# EAGLE design pcb (EAGLE 7.7.0)
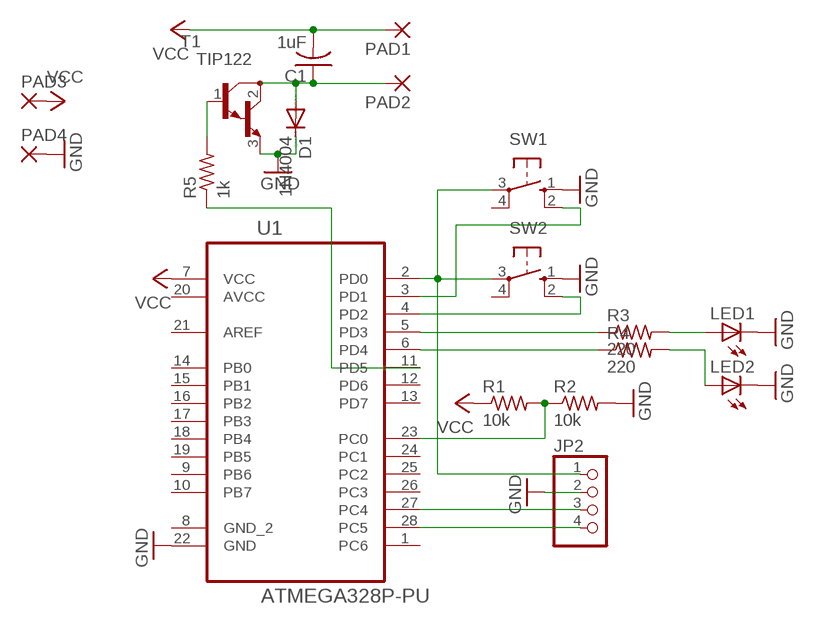
[diagram p0: schematic, sheet 1]

## Parts
C1  1uF  C-US025-025X050  [C025-025X050]
D1  1N4004  [DO41-10]
JP2  PINHD-1X4  [1X04]
LED1  LED5MM  [LED5MM]
LED2  LED5MM  [LED5MM]
PAD1  1,6/0,8  [1,6/0,8]
PAD2  1,6/0,8  [1,6/0,8]
PAD3  1,6/0,8  [1,6/0,8]
PAD4  1,6/0,8  [1,6/0,8]
R1  10k  R-US_0204/5  [0204/5]
R2  10k  R-US_0204/5  [0204/5]
R3  220  R-US_0204/5  [0204/5]
R4  220  R-US_0204/5  [0204/5]
R5  1k  R-US_0204/5  [0204/5]
SW1  10-XX  [B3F-10XX]
SW2  10-XX  [B3F-10XX]
T1  TIP122  [TO220]
U1  ATMEGA328P-PU  [DIP254P762X457-28]

## Nets
GND: D1.C JP2.2 LED1.K(C) LED2.K(C) PAD4.1(P) R2.2 SW1.1(S) SW2.1(S) T1.3(E) U1.22(GND)
N$1: JP2.3 U1.27(PC4)
N$2: C1.1 D1.A PAD2.1(P) T1.2(C)
N$3: JP2.4 U1.28(PC5)
N$4: R1.2 R2.1 U1.23(PC0)
N$5: JP2.1 SW1.3(P) SW2.3(P) U1.2(PD0)
N$6: SW1.2(S1) U1.3(PD1)
N$7: SW2.2(S1) U1.4(PD2)
N$8: R3.1 U1.5(PD3)
N$9: R4.1 U1.6(PD4)
N$10: LED1.A R3.2
N$11: LED2.A R4.2
N$12: R5.2 T1.1(B)
N$13: R5.1 U1.11(PD5)
VCC: C1.2 PAD1.1(P) PAD3.1(P) R1.1 U1.7(VCC)
Unconnected: SW1.4(P1) SW2.4(P1) U1.1(PC6) U1.8(GND_2) U1.9(PB6) U1.10(PB7) U1.12(PD6) U1.13(PD7) U1.14(PB0) U1.15(PB1) U1.16(PB2) U1.17(PB3) U1.18(PB4) U1.19(PB5) U1.21(AREF) U1.24(PC1) U1.25(PC2) U1.26(PC3)

## Power pins joined to a net without a drawn wire
AVCC: U1.20(AVCC)

## Library data of the parts
C1 = adafruit:C-US: CAPACITOR, American symbol
D1 = diode:1N4004: DIODE general purpose rectifier, 1 A
JP2 = pinhead:PINHD-1X4: PIN HEADER
LED1 LED2 = adafruit:LED: LED OSRAM: - CHIPLED LG R971, LG N971, LY N971, LG Q971, LY Q971, LO R971, LY R971 LH N974, LH R974 LS Q976, LO Q976, LY Q976 LO Q996 - Hyper CHIPLED LW Q18S LB Q993, LB Q99A, LB R99A - SideLED LS A670, LO A670, LY A670, LG A670, LP A670 LB A673, LV A673, LT A673, LW A673 LH A674 LY A675 LS A676, LA A676, LO A676, LY A676, LW A676 LS A679, LY A679, LG A679 - Hyper Micro SIDELED® LS Y876, LA Y876, LO Y876, LY Y876 LT Y87S - SmartLED LW L88C, LW L88S LB L89C, LB L89S, LG L890 LS L89K, LO L89K, LY L89K LS L896, LA L896, LO L896, LY L896 - TOPLED LS T670, LO T670, LY T670, LG T670, LP T670 LSG T670, LSP T670, LSY T670, LOP T670, LYG T670 LG T671, LOG T671, LSG T671 LB T673, LV T673, LT T673, LW T673 LH T674 LS T676, LA T676, LO T676, LY T676, LB T676, LH T676, LSB T676, LW T676 LB T67C, LV T67C, LT T67C, LS T67K, LO T67K, LY T67K, LW E67C LS E67B, LA E67B, LO E67B, LY E67B, LB E67C, LV E67C, LT E67C LW T67C LS T679, LY T679, LG T679 LS T770, LO T770, LY T770, LG T770, LP T770 LB T773, LV T773, LT T773, LW T773 LH T774 LS E675, LA E675, LY E675, LS T675 LS T776, LA T776, LO T776, LY T776, LB T776 LHGB T686 LT T68C, LB T68C - Hyper Mini TOPLED® LB M676 - Mini TOPLED Santana® LG M470 LS M47K, LO M47K, LY M47K Source: http://www.osram.convergy.de/
PAD1-PAD4 = wirepad:1,6/0,8: THROUGH-HOLE PAD
R1-R5 = resistor:R-US_: RESISTOR, American symbol
SW1 SW2 = buttons:10-XX: OMRON SWITCH
T1 = transistor:TIP122: NPN BIPOLAR DARLINGTON TRANSISTOR
U1 = Atmel_By_element14_Batch_1-00:ATMEGA328P-PU: 8-bit Microcontroller with In-System Programmable Flash; MPN: ATMEGA328P-PU; OC_FARNELL: 1715487; OC_NEWARK: 15R0268; PACKAGE: PDIP-28; SUPPLIER: Atmel

## Board
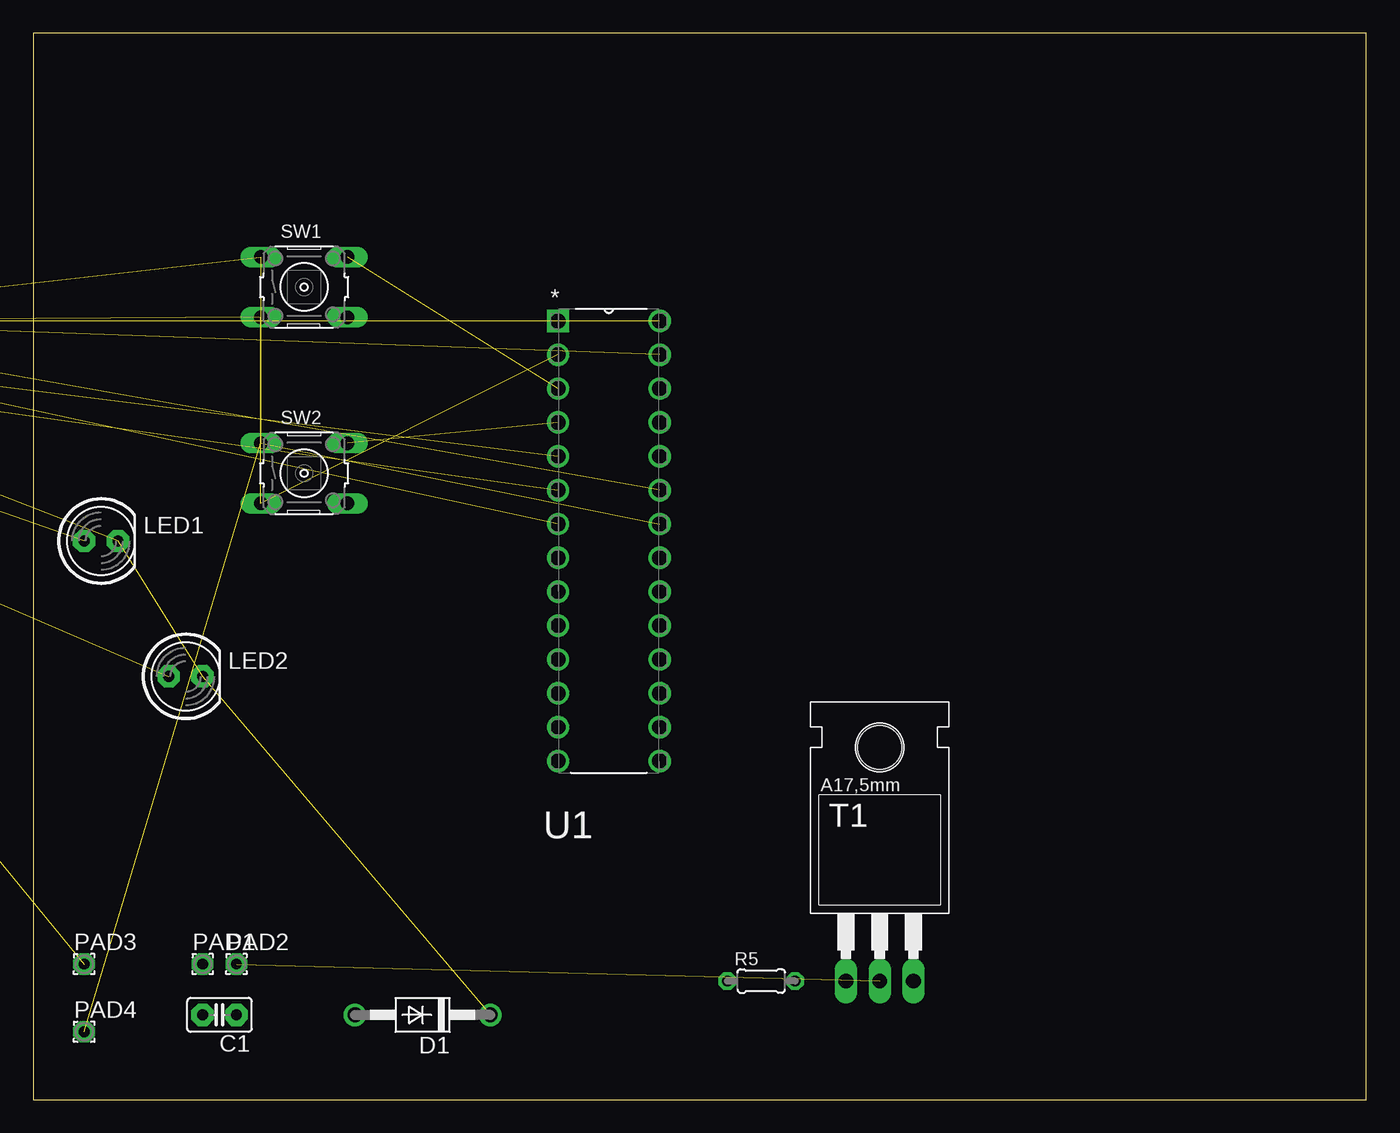
[diagram p1: board, top side]
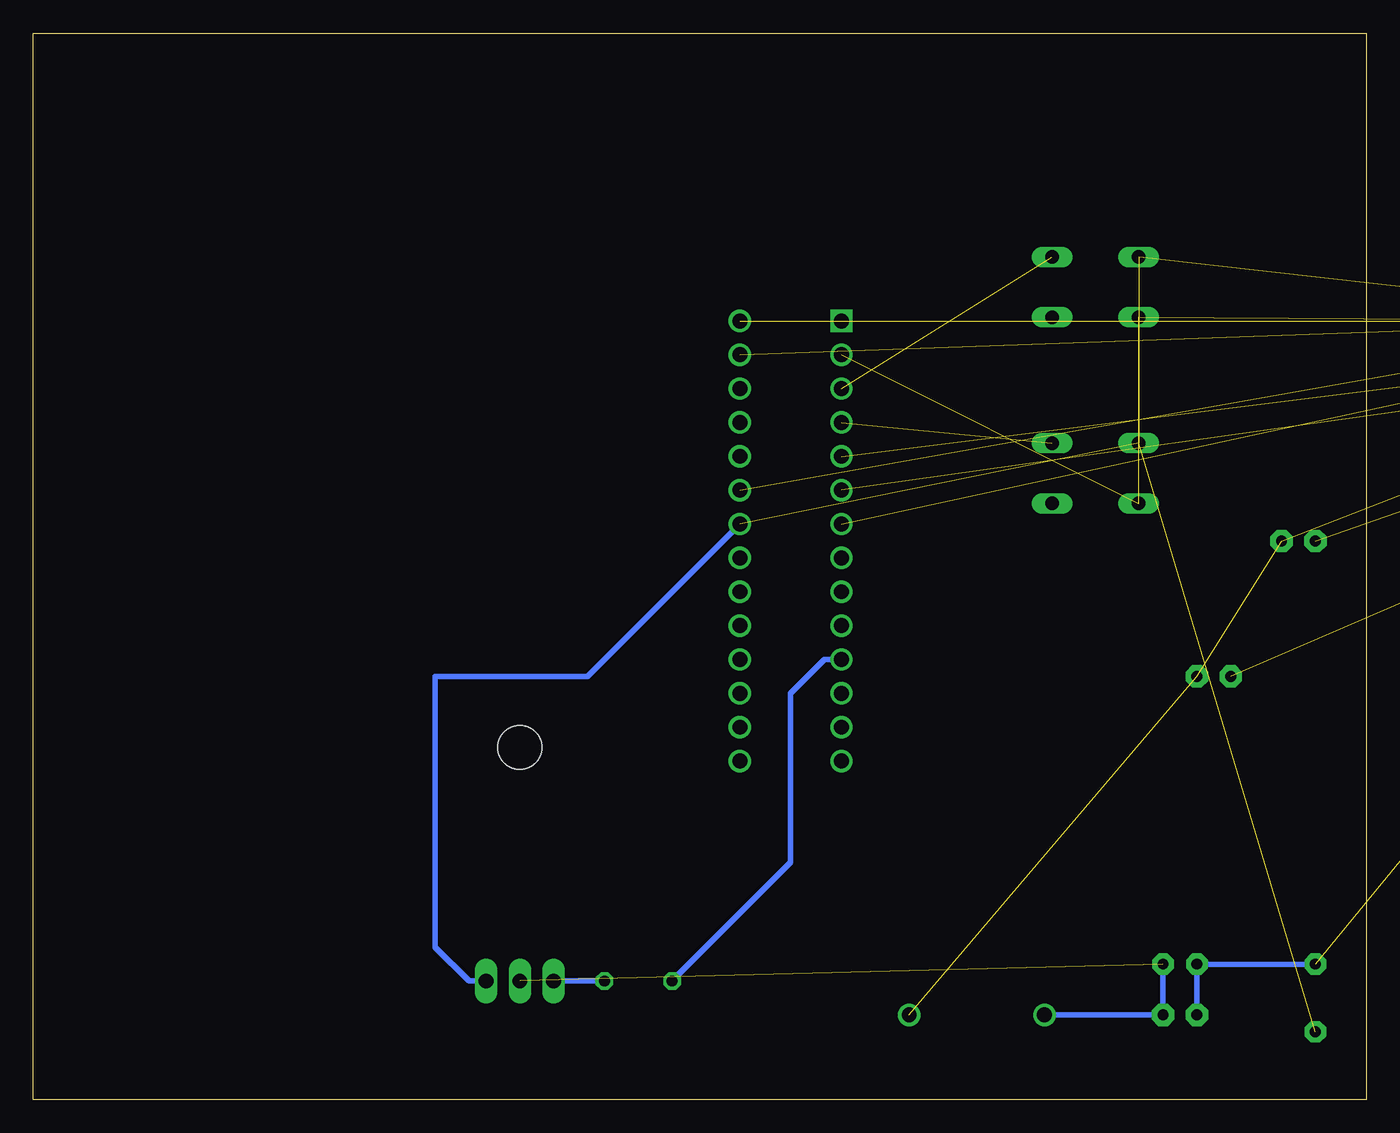
[diagram p2: board, bottom side, seen from below]

Size 100 x 80 mm. Coordinates in mm from the lower left corner, seen from the top.
Outline: 0,0 100,0 100,80 0,80 0,0
Copper layers (1*16): Top 0.035mm / dielectric 1.5mm / Bottom 0.035mm
Design rules "default": minimum track width 10mil, minimum drill 24mil, track to track 8mil, track to pad 8mil, pad to pad 8mil, via to via 8mil, smd to smd 8mil, copper to edge 40mil, drill to drill 8mil, minimum pad ring 10mil, minimum via ring 8mil, stop-mask expansion 4mil, vias tented up to drill 0mil, thermal gap 10mil

### Footprints (pad centres in the part's own frame; a part is rotated, then mirrored left to right if it is on the bottom)
C025-025X050 = drill 0.813 pad 1.676 octagon: 1 -1.27,0; 2 1.27,0
DO41-10 = drill 1.118: A 5.08,0; C -5.08,0
1X04 = drill 1.016 long: 1 -3.81,0; 2 -1.27,0; 3 1.27,0; 4 3.81,0
LED5MM = drill 0.813 pad 1.676 octagon: A -1.27,0; K 1.27,0
1,6/0,8 = drill 0.813 pad 1.6 octagon: 1 0,0
0204/5 = drill 0.813 octagon: 1 -2.54,0; 2 2.54,0
B3F-10XX = drill 1.016 long: 1 -3.251,2.261; 2 3.251,2.261; 3 -3.251,-2.261; 4 3.251,-2.261
TO220 = drill 1.118 long: 1 -2.54,-6.35; 2 0,-6.35; 3 2.54,-6.35 | hole 3.302: 0,11.176
DIP254P762X457-28 = drill 1.118 square: 1 -7.62,33.02 | drill 1.118: 2 -7.62,30.48; 3 -7.62,27.94; 4 -7.62,25.4; 5 -7.62,22.86; 6 -7.62,20.32; 7 -7.62,17.78; 8 -7.62,15.24; 9 -7.62,12.7; 10 -7.62,10.16; 11 -7.62,7.62; 12 -7.62,5.08; 13 -7.62,2.54; 14 -7.62,0; 15 0,0; 16 0,2.54; 17 0,5.08; 18 0,7.62; 19 0,10.16; 20 0,12.7; 21 0,15.24; 22 0,17.78; 23 0,20.32; 24 0,22.86; 25 0,25.4; 26 0,27.94; 27 0,30.48; 28 0,33.02

### Placement (x,y rotation side)
C1  13.97,6.35 180 top
D1  29.21,6.35 180 top
JP2  -24.13,58.42 0 top  (outside the outline)
LED1  5.08,41.91 0 top
LED2  11.43,31.75 0 top
PAD1  12.7,10.16 0 top
PAD2  15.24,10.16 0 top
PAD3  3.81,10.16 0 top
PAD4  3.81,5.08 0 top
R1  -34.29,59.69 0 top  (outside the outline)
R2  -41.91,59.69 0 top  (outside the outline)
R3  -49.53,59.69 0 top  (outside the outline)
R4  -57.15,59.69 0 top  (outside the outline)
R5  54.61,8.89 0 top
SW1  20.32,60.96 0 top
SW2  20.32,46.99 0 top
T1  63.5,15.24 0 top
U1  46.99,25.4 0 top

### Tracks (layer width: path | path; a pad name or v marks a point on that pad's centre or on a via)
GND  (8 unrouted)
  Bottom 0.406: T1.3 67.31,8.89 69.85,11.43 69.85,31.75 58.42,31.75 U1.22
N$1  (1 unrouted)
N$2  (1 unrouted)
  Bottom 0.406: D1.A C1.1 PAD2.1
N$3  (1 unrouted)
N$4  (2 unrouted)
N$5  (3 unrouted)
N$6  (1 unrouted)
N$7  (1 unrouted)
N$8  (1 unrouted)
N$9  (1 unrouted)
N$10  (1 unrouted)
N$11  (1 unrouted)
N$12
  Bottom 0.406: T1.1 R5.2
N$13
  Bottom 0.406: U1.11 40.64,33.02 43.18,30.48 43.18,17.78 R5.1
VCC  (2 unrouted)
  Bottom 0.406: C1.2 PAD1.1 PAD3.1